# Altium schematic sheet nRF52832 MCU.SchDoc
size A
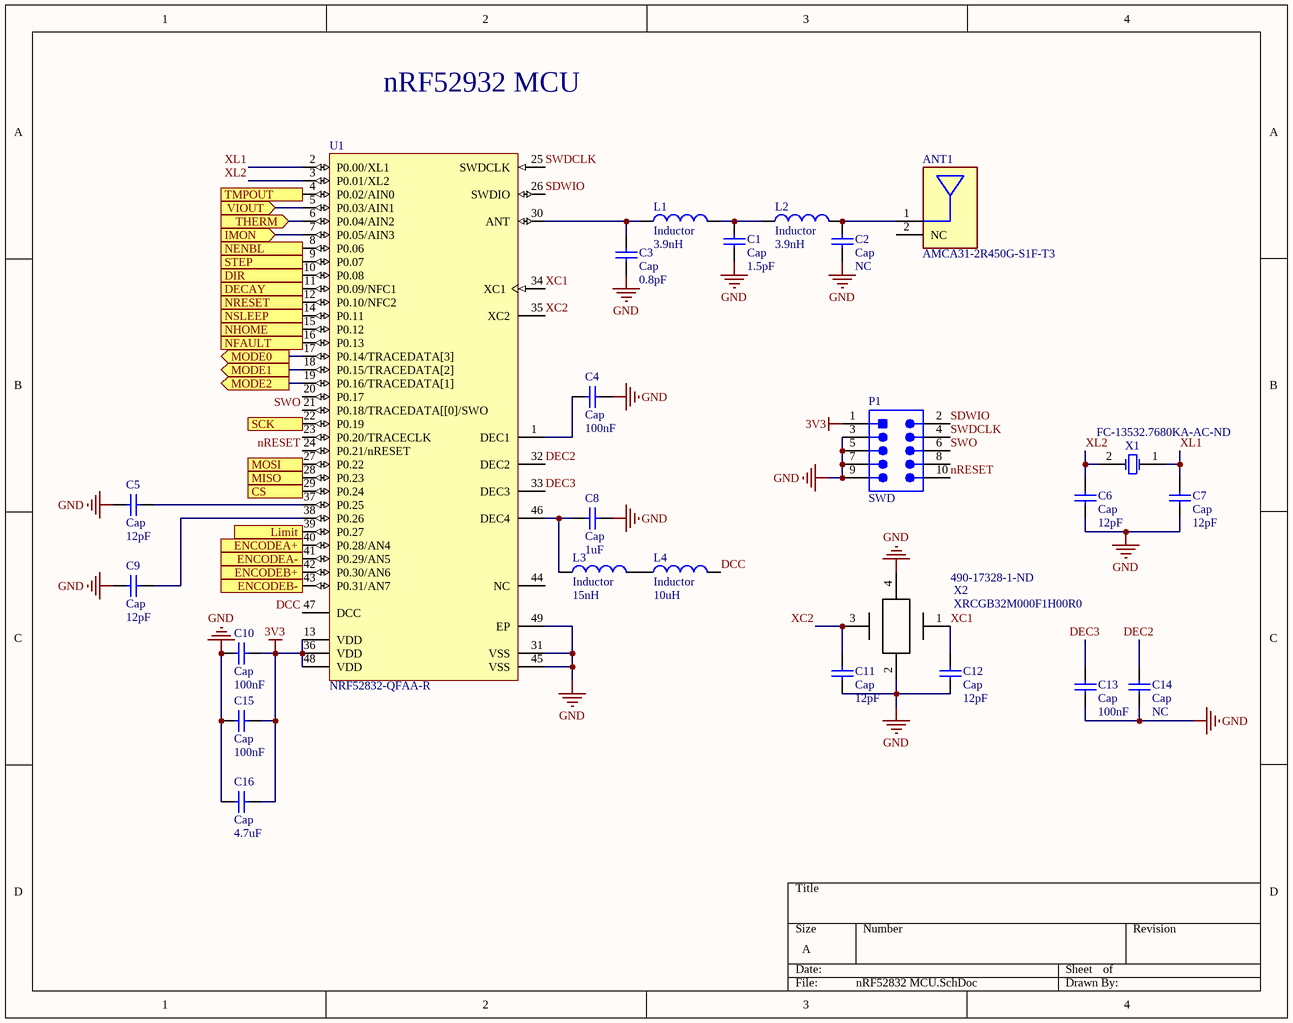
[diagram p0: nRF52832 MCU.SchDoc]

## Parts
ANT1  AMCA31-2R450G-S1F-T3  [FP-AMCA31-MFG]
C1  Cap  value 1.5pF  [0402-A]
C2  Cap  value NC  [0402-A]
C3  Cap  value 0.8pF  [0402-A]
C4  Cap  value 100nF  [1608[0603]]
C5  Cap  value 12pF  [0402-A]
C6  Cap  value 12pF  [0402-A]
C7  Cap  value 12pF  [0402-A]
C8  Cap  value 1uF  [1608[0603]]
C9  Cap  value 12pF  [0402-A]
C10  Cap  value 100nF  [1608[0603]]
C11  Cap  value 12pF  [0402-A]
C12  Cap  value 12pF  [0402-A]
C13  Cap  value 100nF  [1608[0603]]
C14  Cap  value NC  [0402-A]
C15  Cap  value 100nF  [1608[0603]]
C16  Cap  value 4.7uF  [6-0805_M]
L1  Inductor  value 3.9nH  [0402-A]
L2  Inductor  value 3.9nH  [0402-A]
L3  Inductor  value 15nH  [0402-A]
L4  Inductor  value 10uH  [1608[0603]]
P1  SWD  [SMTC-FTSH-105-01-L-DV-K_V]
U1  NRF52832-QFAA-R  [NRSC-QF-48_M]
X1  FC-135 32.7680KA-AC  [FC-13532.7680KA-AC-ND]  (value not drawn)
X2  XRCGB32M000F1H00R0  Supplier Part Number 1: 490-17328-1-ND  [XRCGB32M000F1H00R0]

## Ports
CS (out), DECAY (out), DIR (out), ENCODEA+ (in), ENCODEA- (in), ENCODEB+ (in), ENCODEB- (in), IMON (in), Limit (in), MISO (in), MODE0 (out), MODE1 (out), MODE2 (out), MOSI (out), NENBL (out), NFAULT (out), NHOME (out), NRESET (out), NSLEEP (out), SCK (out), STEP (out), THERM (in), TMPOUT (in), VIOUT (in)

## Nets
3V3: C10.1 C15.1 C16.1 P1.1 U1.13(VDD) U1.36(VDD) U1.48(VDD)
GND: C1.1 C2.1 C3.1 C4.1 C5.2 C6.1 C7.1 C8.1 C9.2 C10.2 C11.1 C12.1 C13.2 C14.2 C15.2 C16.2 P1.3 P1.5 P1.7 P1.9 U1.31(VSS) U1.45(VSS) U1.49(EP) X2.2 X2.4
CS: U1.29(P0.24) ; port CS
DCC: L4.2 U1.47(DCC)
DEC2: C14.1 U1.32(DEC2)
DEC3: C13.1 U1.33(DEC3)
DECAY: U1.11(P0.09/NFC1) ; port DECAY
DIR: U1.10(P0.08) ; port DIR
ENCODEA+: U1.40(P0.28/AN4) ; port ENCODEA+
ENCODEA-: U1.41(P0.29/AN5) ; port ENCODEA-
ENCODEB+: U1.42(P0.30/AN6) ; port ENCODEB+
ENCODEB-: U1.43(P0.31/AN7) ; port ENCODEB-
IMON: U1.7(P0.05/AIN3) ; port IMON
Limit: U1.39(P0.27) ; port Limit
MISO: U1.28(P0.23) ; port MISO
MODE0: U1.17(P0.14/TRACEDATA[3]) ; port MODE0
MODE1: U1.18(P0.15/TRACEDATA[2]) ; port MODE1
MODE2: U1.19(P0.16/TRACEDATA[1]) ; port MODE2
MOSI: U1.27(P0.22) ; port MOSI
NENBL: U1.8(P0.06) ; port NENBL
NFAULT: U1.16(P0.13) ; port NFAULT
NHOME: U1.15(P0.12) ; port NHOME
NRESET: U1.12(P0.10/NFC2) ; port NRESET
nRESET: P1.10 U1.24(P0.21/nRESET)  [a separate net that carries the same name]
NSLEEP: U1.14(P0.11) ; port NSLEEP
SCK: U1.22(P0.19) ; port SCK
SDWIO: P1.2 U1.26(SWDIO)
STEP: U1.9(P0.07) ; port STEP
SWDCLK: P1.4 U1.25(SWDCLK)
SWO: P1.6 U1.21(P0.18/TRACEDATA[[0]/SWO)
THERM: U1.6(P0.04/AIN2) ; port THERM
TMPOUT: U1.4(P0.02/AIN0) ; port TMPOUT
VIOUT: U1.5(P0.03/AIN1) ; port VIOUT
XC1: C12.2 U1.34(XC1) X2.1
XC2: C11.2 U1.35(XC2) X2.3
XL1: C7.2 U1.2(P0.00/XL1) X1.1(OSC1)
XL2: C6.2 U1.3(P0.01/XL2) X1.2(OSC2)
NetANT1_1: ANT1.1(Feed_Point) C2.2 L2.2
NetC1_2: C1.2 L1.2 L2.1
NetC3_2: C3.2 L1.1 U1.30(ANT)
NetC4_2: C4.2 U1.1(DEC1)
NetC5_1: C5.1 U1.37(P0.25)
NetC8_2: C8.2 L3.1 U1.46(DEC4)
NetC9_1: C9.1 U1.38(P0.26)
NetL3_2: L3.2 L4.1

Not connected (* = marked no-connect by the designer): ANT1 2(NC); P1 8; U1 20(P0.17) 23(P0.20/TRACECLK) 44(NC)

## Notes on the sheet
- nRF52932 MCU

## Library data of the parts
ANT1 = CMP-27836-000002-1: RF ANT 2.4GHZ CHIP SOLDER SMD; Manufacturer: Abracon; Power Rating: 3W; Max Frequency: 2450MHz; Impedance: 50Ω; Number Of Bands: 1; Bandwidth: 100MHz; RoHS: TRUE; ComponentLink2Description: Datasheet; Category: Ant; Temperature: -40°C to +85°C; Device Class L3: RF Antennas; Octopart: https://octopart.com/amca31-2r450g-s1f-t3-abracon-31435383; Manufacturer Part Number: AMCA31-2R450G-S1F-T3; Digikey Description: RF ANT 2.4GHZ CHIP SOLDER SMD; Package: AMCA31; Temperature Range High: +85°C; Automotive: No; Device Class L2: RF Semiconductors and Devices; ComponentLink2URL: https://abracon.com/chip-antenna/AMCA31-2R450G-S1F-T3.pdf; Temperature Range Low: -40°C; Device Class L1: Integrated Circuits (ICs); Lead Free: Yes; Height: 1.4mm; Mouser Description: Antennas 2.45GHz BW 90dB + Gain -1 dBi avg.
C1-C16 = Cap: Capacitor; Published: 8-Jun-2000; LatestRevisionDate: 17-Jul-2002; LatestRevisionNote: Re-released for DXP Platform.; PackageReference: RAD-0.3; Publisher: Altium Limited; PackageDescription: Radial Cap, Thru-Hole; 2 Leads; 0.3 in Pin Spacing
L1-L4 = Inductor: Code_IEC: 1005; Published: 8-Jun-2000; LatestRevisionDate: 29-May-2009; LatestRevisionNote: IPC-7351 Footprint Added.; PackageReference: 0402-A; Publisher: Altium Limited; PackageDescription: Chip Inductor; Code_JEITA: 0402
P1 = CMP-2000-05353-1: Male Header, Pitch 1.27 mm, 2 x 5 Position, Height 6.25 mm; Manufacturer: Samtec; Pitch: 0.050"(1.27mm); Other Names: Q3937619; Number of Positions: 10; Mating Products: SFMC-105-L2-S-D-TR-ND / -CONN.05"SURFACE10POSSMT / FLE-105-01-G-DV-TR-ND / -CONNSKT1.27MM10POSDUALSMD / FLE-105-01-G-DV-A-P-ND / -CONNSKT1.27MM10POSDUALSMD / FLE-105-01-G-DV-A-ND / -CONNSKT1.27MM10POSDUALSMD / CLP-105-02-G-D-P-TR-ND / -CONNRCPT10POSDUAL.05"SMD / SAM1155-05-ND / -CONNRCPT10POSDUAL.05"SMD / SAM1154-05-ND / -CONNRCPT10POSDUAL.05"SMD / SAM1153-05-ND / -CONNRCPT10POSDUAL.05"SMD / SAM1226-05-ND / -CONNRCPT.05"10POSDUALSMD; Number of Positions Loaded: All; Connector Type: Header,Unshrouded; Product Training Modules: Board-to-BoardConnectors; Datasheet Version: Rev. ET, 10/1995; Number of Rows: 2; Standard Package: 1; Package Description: Male Header, Pitch 1.27 mm, 2 x 5 Position, Height 5.97 mm, Tail Length 4.32 mm; Contact Finish Thickness: 10µin(0.25µm); Series: FTSH; Termination: Solder; Contact Type: MalePin; Color: Black; Package Reference: FTSH-105-01-L-DV-K; Family: RectangularConnectors-Headers,MalePins; Package URL: http://suddendocs.samtec.com/prints/ftsh-1xx-xx-xxx-dv-xxx-footprint.pdf; Packaging: Tube; Mounting Type: SurfaceMount; Category: Connectors,Interconnects; Datasheet URL: http://suddendocs.samtec.com/prints/ftsh-1xx-xx-xxx-dv-xxx-mkt.pdf; Row Spacing: 0.050"(1.27mm); Manufacturer URL: http://www.samtec.com/; Contact Mating Length: 0.120"(3.05mm); Contact Finish: Gold
U1 = CMP-2100-03661-1: Multiprotocol Bluetooth Smart, ANT/ANT+ and Proprietary System-on-Chip, 2.4 GHz, 256 KB FLASH, 1.7 to 3.6 V, -40 to 85 degC, 48-Pin QFN, RoHS, Tape and Reel; Manufacturer: Nordic Semiconductor; Frequency: 2.4GHz; Datasheet Version: Rev. 1.0, 02/2016; Datasheet URL: http://infocenter.nordicsemi.com/pdf/nRF52832_PS_v1.0.pdf; Mount: SurfaceMount; Max Operating Temperature: 85degC; Manufacturer URL: http://www.nordicsemi.com/eng/Products/; Lead Free: LeadFree; Min Operating Temperature: -40degC; RoHSCompliant: true; Package Reference: QF-48; Package Description: 48-Pin Quad Flat No-lead Package, Body 6 x 6 mm, Pitch 0.4 mm, Thermal Pad 4.6 x 4.6 mm; Max Frequency: 2.4GHz; Packaging: TapeandReel
X1 = XTAL: 32.768kHz Crystal Oscillator; Published: 8-Jun-2000; LatestRevisionDate: 17-Jul-2002; LatestRevisionNote: Re-released for DXP Platform.; PackageReference: R38; Publisher: Altium Limited; PackageDescription: Crystal, Thru-Hole; 2 Leads; Body 3.1 x 8.2 mm (Dia.xH); Supplier 1: Digi-Key; Supplier Part Number 1: FC-13532.7680KA-AC-ND
X2 = XRCGB32M000F1H00R0: 32MHz Crystal Oscillator; Supplier 1: Digi-Key